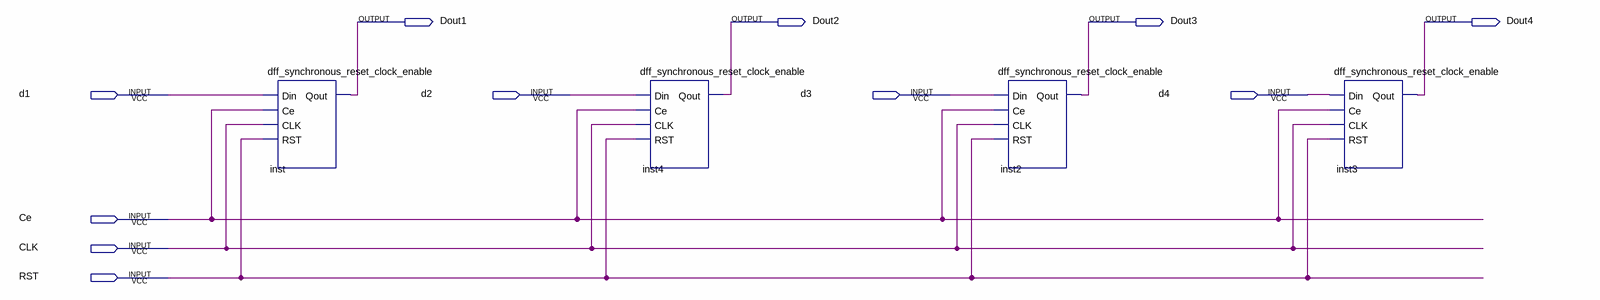
[diagram p0: schematic sheet]
// Quartus schematic four_synchronous_dff_clock_enable.bdf as structural Verilog: 4 symbols, 11 pins
module four_synchronous_dff_clock_enable (
  input  d1,
  input  d2,
  input  d3,
  input  d4,
  input  Ce,
  input  CLK,
  input  RST,
  output Dout1,
  output Dout2,
  output Dout3,
  output Dout4
);

  dff_synchronous_reset_clock_enable inst (.Din(d1), .Ce(Ce), .CLK(CLK), .RST(RST), .Qout(Dout1));
  dff_synchronous_reset_clock_enable inst4 (.Din(d2), .Ce(Ce), .CLK(CLK), .RST(RST), .Qout(Dout2));
  dff_synchronous_reset_clock_enable inst2 (.Din(d3), .Ce(Ce), .CLK(CLK), .RST(RST), .Qout(Dout3));
  dff_synchronous_reset_clock_enable inst3 (.Din(d4), .Ce(Ce), .CLK(CLK), .RST(RST), .Qout(Dout4));
endmodule
